# Altium schematic sheet STM32N657.SchDoc
size A2
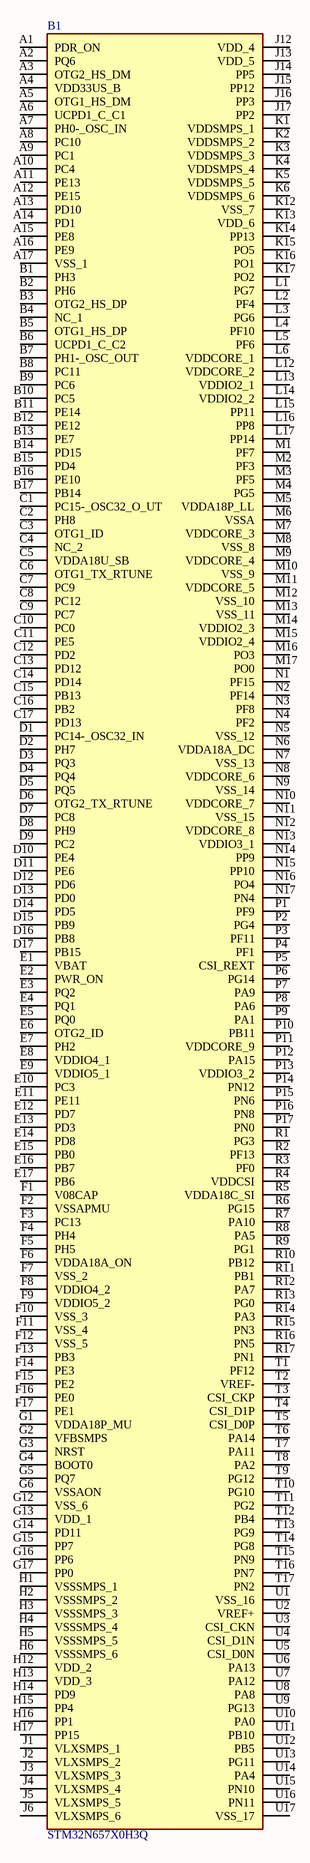
[diagram p0: STM32N657.SchDoc]

## Parts
B1  STM32N657X0H3Q  [BGA264C80P17X17_1400X1400X100]

## Nets

Not connected (* = marked no-connect by the designer): B1 A1(PDR_ON) A2(PQ6) A3(OTG2_HS_DM) A4(VDD33US_B) A5(OTG1_HS_DM) A6(UCPD1_C_C1) A7(PH0-_OSC_IN) A8(PC10) A9(PC1) A10(PC4) A11(PE13) A12(PE15) A13(PD10) A14(PD1) A15(PE8) A16(PE9) A17(VSS_1) B1(PH3) B2(PH6) B3(OTG2_HS_DP) B4(NC_1) B5(OTG1_HS_DP) B6(UCPD1_C_C2) B7(PH1-_OSC_OUT) B8(PC11) B9(PC6) B10(PC5) B11(PE14) B12(PE12) B13(PE7) B14(PD15) B15(PD4) B16(PE10) B17(PB14) C1(PC15-_OSC32_O_UT) C2(PH8) C3(OTG1_ID) C4(NC_2) C5(VDDA18U_SB) C6(OTG1_TX_RTUNE) C7(PC9) C8(PC12) C9(PC7) C10(PC0) C11(PE5) C12(PD2) C13(PD12) C14(PD14) C15(PB13) C16(PB2) C17(PD13) D1(PC14-_OSC32_IN) D2(PH7) D3(PQ3) D4(PQ4) D5(PQ5) D6(OTG2_TX_RTUNE) D7(PC8) D8(PH9) D9(PC2) D10(PE4) D11(PE6) D12(PD6) D13(PD0) D14(PD5) D15(PB9) D16(PB8) D17(PB15) E1(VBAT) E2(PWR_ON) E3(PQ2) E4(PQ1) E5(PQ0) E6(OTG2_ID) E7(PH2) E8(VDDIO4_1) E9(VDDIO5_1) E10(PC3) E11(PE11) E12(PD7) E13(PD3) E14(PD8) E15(PB0) E16(PB7) E17(PB6) F1(V08CAP) F2(VSSAPMU) F3(PC13) F4(PH4) F5(PH5) F6(VDDA18A_ON) F7(VSS_2) F8(VDDIO4_2) F9(VDDIO5_2) F10(VSS_3) F11(VSS_4) F12(VSS_5) F13(PB3) F14(PE3) F15(PE2) F16(PE0) F17(PE1) G1(VDDA18P_MU) G2(VFBSMPS) G3(NRST) G4(BOOT0) G5(PQ7) G6(VSSAON) G12(VSS_6) G13(VDD_1) G14(PD11) G15(PP7) G16(PP6) G17(PP0) H1(VSSSMPS_1) H2(VSSSMPS_2) H3(VSSSMPS_3) H4(VSSSMPS_4) H5(VSSSMPS_5) H6(VSSSMPS_6) H12(VDD_2) H13(VDD_3) H14(PD9) H15(PP4) H16(PP1) H17(PP15) J1(VLXSMPS_1) J2(VLXSMPS_2) J3(VLXSMPS_3) J4(VLXSMPS_4) J5(VLXSMPS_5) J6(VLXSMPS_6) J12(VDD_4) J13(VDD_5) J14(PP5) J15(PP12) J16(PP3) J17(PP2) K1(VDDSMPS_1) K2(VDDSMPS_2) K3(VDDSMPS_3) K4(VDDSMPS_4) K5(VDDSMPS_5) K6(VDDSMPS_6) K12(VSS_7) K13(VDD_6) K14(PP13) K15(PO5) K16(PO1) K17(PO2) L1(PG7) L2(PF4) L3(PG6) L4(PF10) L5(PF6) L6(VDDCORE_1) L12(VDDCORE_2) L13(VDDIO2_1) L14(VDDIO2_2) L15(PP11) L16(PP8) L17(PP14) M1(PF7) M2(PF3) M3(PF5) M4(PG5) M5(VDDA18P_LL) M6(VSSA) M7(VDDCORE_3) M8(VSS_8) M9(VDDCORE_4) M10(VSS_9) M11(VDDCORE_5) M12(VSS_10) M13(VSS_11) M14(VDDIO2_3) M15(VDDIO2_4) M16(PO3) M17(PO0) N1(PF15) N2(PF14) N3(PF8) N4(PF2) N5(VSS_12) N6(VDDA18A_DC) N7(VSS_13) N8(VDDCORE_6) N9(VSS_14) N10(VDDCORE_7) N11(VSS_15) N12(VDDCORE_8) N13(VDDIO3_1) N14(PP9) N15(PP10) N16(PO4) N17(PN4) P1(PF9) P2(PG4) P3(PF11) P4(PF1) P5(CSI_REXT) P6(PG14) P7(PA9) P8(PA6) P9(PA1) P10(PB11) P11(VDDCORE_9) P12(PA15) P13(VDDIO3_2) P14(PN12) P15(PN6) P16(PN8) P17(PN0) R1(PG3) R2(PF13) R3(PF0) R4(VDDCSI) R5(VDDA18C_SI) R6(PG15) R7(PA10) R8(PA5) R9(PG1) R10(PB12) R11(PB1) R12(PA7) R13(PG0) R14(PA3) R15(PN3) R16(PN5) R17(PN1) T1(PF12) T2(VREF-) T3(CSI_CKP) T4(CSI_D1P) T5(CSI_D0P) T6(PA14) T7(PA11) T8(PA2) T9(PG12) T10(PG10) T11(PG2) T12(PB4) T13(PG9) T14(PG8) T15(PN9) T16(PN7) T17(PN2) U1(VSS_16) U2(VREF+) U3(CSI_CKN) U4(CSI_D1N) U5(CSI_D0N) U6(PA13) U7(PA12) U8(PA8) U9(PG13) U10(PA0) U11(PB10) U12(PB5) U13(PG11) U14(PA4) U15(PN10) U16(PN11) U17(VSS_17)

## Library data of the parts
B1 = STM32N657X0H3Q: High performance Arm Cortex-M55 MCU, 800MHz, 4.2MB SRAM, Neural-ART accelerator 600 GOPS, NeoChrom GPU, JPEG Codec, H-264 enc, HW crypto; Manufacturer_Name: STMicroelectronics; Geometry.Height: 1mm; Mouser Part Number: 511-STM32N657X0H3Q; Mouser Price/Stock: https://www.mouser.co.uk/ProductDetail/STMicroelectronics/STM32N657X0H3Q?qs=%252BXxaIXUDbq0JgAtfYs%252BpjA%3D%3D; Manufacturer_Part_Number: STM32N657X0H3Q; Datasheet Link: https://www.st.com/resource/en/datasheet/stm32n657a0.pdf